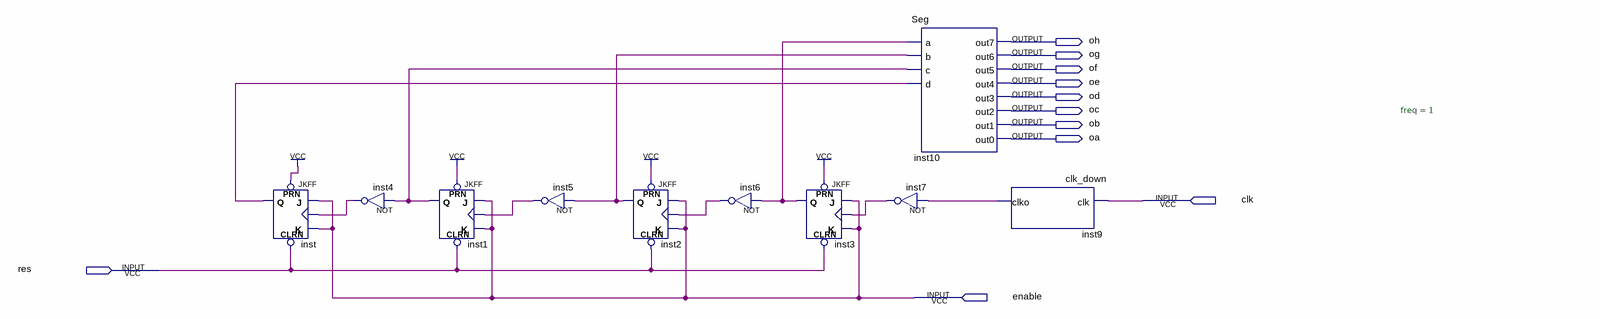
[diagram p0: schematic sheet]
// Quartus schematic LAB07.bdf as structural Verilog: 10 symbols, 11 pins
module LAB07 (
  input  clk,
  input  res,
  input  enable,
  output oh,
  output og,
  output of,
  output oe,
  output od,
  output oc,
  output ob,
  output oa
);

  wire inst1_q, inst2_q, inst3_q, inst4_out, inst5_out, inst6_out, inst7_out, inst9_clko, inst_q;

  JKFF inst (.PRN(1'b1), .CLRN(res), .K(enable), .J(enable), .CLK(inst4_out), .Q(inst_q));
  not inst4 (inst4_out, inst1_q);
  JKFF inst1 (.PRN(1'b1), .CLRN(res), .K(enable), .J(enable), .CLK(inst5_out), .Q(inst1_q));
  not inst5 (inst5_out, inst2_q);
  JKFF inst2 (.PRN(1'b1), .CLRN(res), .K(enable), .J(enable), .CLK(inst6_out), .Q(inst2_q));
  not inst6 (inst6_out, inst3_q);
  JKFF inst3 (.PRN(1'b1), .CLRN(res), .K(enable), .J(enable), .CLK(inst7_out), .Q(inst3_q));
  Seg inst10 (
    .a(inst3_q), .b(inst2_q), .c(inst1_q), .d(inst_q), .out7(oh), .out6(og), .out5(of), .out4(oe), .out3(od),
    .out2(oc), .out1(ob), .out0(oa));
  not inst7 (inst7_out, inst9_clko);
  clk_down #(.freq(1)) inst9 (.clk(clk), .clko(inst9_clko));
endmodule
